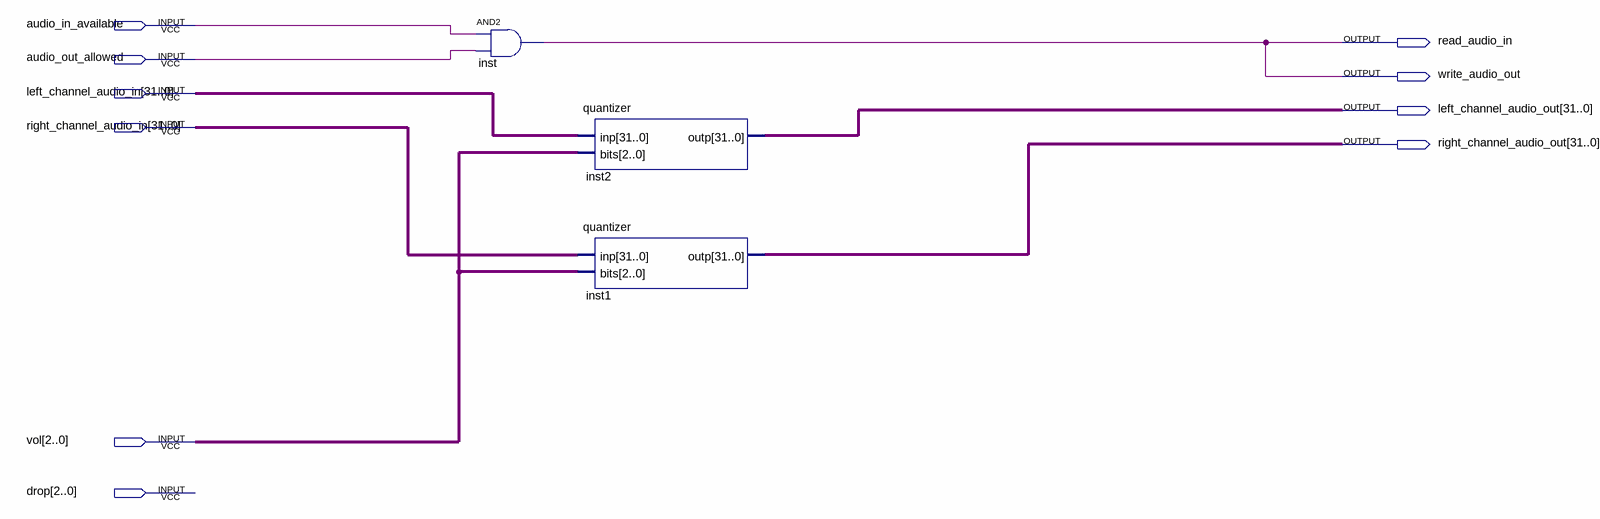
[diagram p0: schematic sheet]
// Quartus schematic filter_demo.bdf as structural Verilog: 3 symbols, 10 pins
module filter_demo (
  input  audio_in_available,
  input  audio_out_allowed,
  input  [31:0] left_channel_audio_in,
  input  [31:0] right_channel_audio_in,
  input  [2:0] vol,
  input  [2:0] drop,
  output read_audio_in,
  output write_audio_out,
  output [31:0] left_channel_audio_out,
  output [31:0] right_channel_audio_out
);

  and inst (read_audio_in, audio_in_available, audio_out_allowed);
  quantizer inst2 (.inp(left_channel_audio_in), .bits(vol), .outp(left_channel_audio_out));
  quantizer inst1 (.inp(right_channel_audio_in), .bits(vol), .outp(right_channel_audio_out));

  assign write_audio_out = read_audio_in;
endmodule
